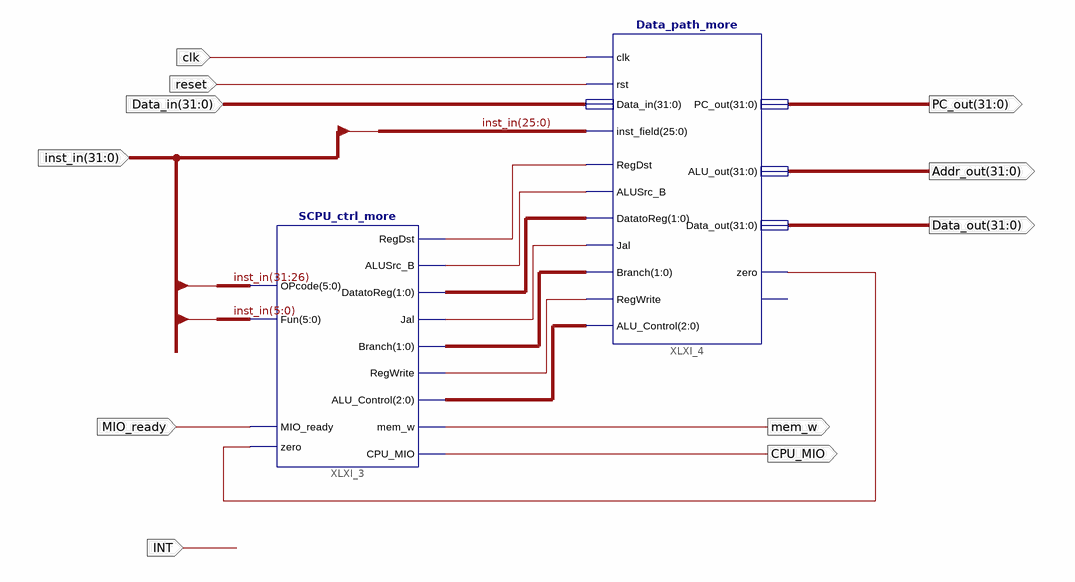
[diagram p0: schematic sheet 1]
// Xilinx ISE schematic SCPU_More.sch (kintex7) as structural Verilog: 2 symbols, 11 ports
module SCPU_More (
  input  clk,
  input  reset,
  input  [31:0] Data_in,
  input  [31:0] inst_in,
  input  MIO_ready,
  input  INT,
  output mem_w,
  output CPU_MIO,
  output [31:0] PC_out,
  output [31:0] Addr_out,
  output [31:0] Data_out
);

  wire XLXN_7, XLXN_8, XLXN_10, XLXN_12, XLXN_18;
  wire [1:0] XLXN_16, XLXN_17;
  wire [2:0] XLXN_13;

  SCPU_ctrl_more XLXI_3 (
    .RegDst(XLXN_7), .ALUSrc_B(XLXN_8), .DatatoReg(XLXN_16), .Jal(XLXN_10), .ALU_Control(XLXN_13),
    .CPU_MIO(CPU_MIO), .mem_w(mem_w), .Fun(inst_in[5:0]), .OPcode(inst_in[31:26]), .Branch(XLXN_17),
    .RegWrite(XLXN_12), .MIO_ready(MIO_ready), .zero(XLXN_18));
  Data_path_more XLXI_4 (
    .RegDst(XLXN_7), .ALUSrc_B(XLXN_8), .DatatoReg(XLXN_16), .Jal(XLXN_10), .Branch(XLXN_17),
    .RegWrite(XLXN_12), .ALU_Control(XLXN_13), .Data_in(Data_in), .inst_field(inst_in[25:0]), .clk(clk),
    .rst(reset), .PC_out(PC_out), .ALU_out(Addr_out), .Data_out(Data_out), .zero(XLXN_18));  // open: overflow
endmodule
